# Altium schematic sheet Sheet_1.schdoc
size 133 x 94 mm
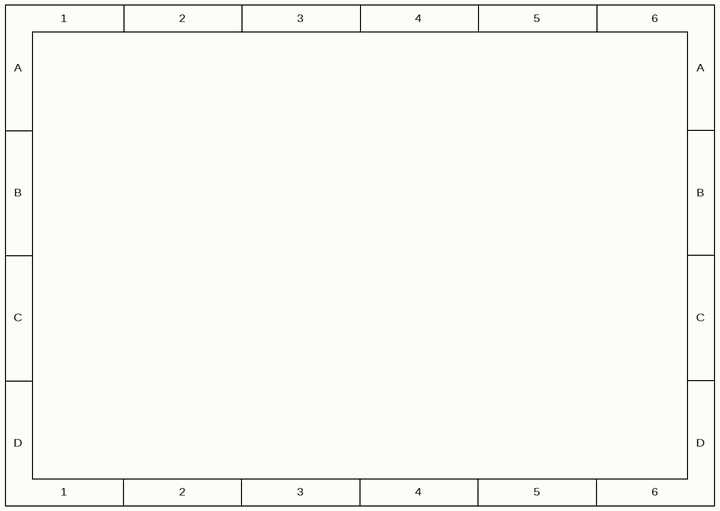
[diagram p0: Sheet_1.schdoc]

## Parts
JP5  M02PTH  [1X02]
MOTORS  4 HEADER  [HEADER4]
SERVO1  M031X03_NO_SILK  [1X03_NO_SILK]
SERVO2  M031X03_NO_SILK  [1X03_NO_SILK]
U1  Node  [NODEMCU V3 LOLIN]
U2  TB6612  [DUAL TB6612FNG]

## Nets
NetJP5_1: JP5.1 SERVO1.2 SERVO2.2 U1.15(Vin) U2.1(VM)
NetJP5_2: JP5.2 U1.10(GND)
NetMOTORS_1: MOTORS.1 U2.7(B01)
NetMOTORS_2: MOTORS.2 U2.6(B02)
NetMOTORS_3: MOTORS.3 U2.5(A02)
NetMOTORS_4: MOTORS.4 U2.4(A01)
NetSERVO1_1: SERVO1.1 SERVO2.1 U1.17(GND)
NetSERVO1_3: SERVO1.3 U1.20(D8)
NetSERVO2_3: SERVO2.3 U1.21(D7)
NetU1_22: U1.22(D6) U2.16(PWMA)
NetU1_23: U1.23(D5) U2.11(BIN2)
NetU1_24: U1.24(GND) U2.8(GND)
NetU1_25: U1.25(3.3V) U2.2(VCC) U2.13(STBY)
NetU1_27: U1.27(D3) U2.14(AIN1)
NetU1_28: U1.28(D2) U2.10(PWMB)
NetU1_29: U1.29(D1) U2.12(BIN1)
NetU1_30: U1.30(D0) U2.15(AIN2)

Not connected (* = marked no-connect by the designer): U1 1(A0) 2(GND) 3(VU) 4(S3) 5(S2) 6(S1) 7(SC) 8(S0) 9(SK) 11(3.3V) 12(EN) 13(RST) 14(GND) 16(3.3V) 18(TX) 19(RX) 26(D4); U2 3(GND) 9(GND)

## Library data of the parts
JP5 = M02PTH: description: Header 2; timeStamp: 1461766410; BOM_Manufacturer Part: ?; spicePre: J
MOTORS = 4 HEADER: description: 4 Pin Header; timeStamp: 1453256398; BOM_Manufacturer Part: ?; spicePre: J
SERVO1 SERVO2 = M031X03_NO_SILK: description: Header 3; Contributor: SparkFun; BOM_Manufacturer Part: ?; spicePre: J
U1 = Node: Contributor: nitink; BOM_Manufacturer Part: NodeMcu V3 LoLin; spicePre: U
U2 = TB6612: description: TB6612 The TB6612FNG motor driver can control up to two DC motors at a constant current of 1.2A (3.2A peak).; timeStamp: 1463550914; BOM_Supplier: SparkFun; BOM_Manufacturer Part: ?; spicePre: U